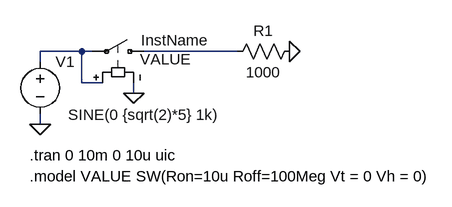
[diagram p0: schematic Switch_Circuit.asc]
Switch_Circuit.asc, the LTspice schematic file:
Version 4
SHEET 1 880 680
WIRE -96 96 -160 96
WIRE -80 96 -96 96
WIRE 144 96 0 96
WIRE -160 112 -160 96
WIRE -96 144 -96 96
WIRE -64 144 -96 144
WIRE -16 160 -16 144
WIRE -160 208 -160 192
FLAG -160 208 0
FLAG 224 96 0
FLAG -16 160 0
SYMBOL res 240 80 R90
WINDOW 0 0 56 VBottom 2
WINDOW 3 32 56 VTop 2
SYMATTR InstName R1
SYMATTR Value 1000
SYMBOL voltage -160 96 R0
WINDOW 3 277 97 Right 2
WINDOW 123 0 0 Left 0
WINDOW 39 0 0 Left 0
SYMATTR InstName V1
SYMATTR Value SINE(0 {sqrt(2)*5} 1k)
SYMBOL sw 16 96 M270
WINDOW 0 17 21 VLeft 2
WINDOW 3 -12 22 VLeft 2
SYMATTR InstName InstName
SYMATTR Value VALUE
TEXT -176 256 Left 2 !.tran 0 10m 0 10u uic
TEXT -176 288 Left 2 !.model VALUE SW(Ron=10u Roff=100Meg Vt = 0 Vh = 0)

The netlist it stands for:
* Switch_Circuit.asc
R1 0 N002 1000
V1 N001 0 SINE(0 {sqrt(2)*5} 1k)
S§InstName N002 N001 N001 0 VALUE
.tran 0 10m 0 10u uic
.model VALUE SW(Ron=10u Roff=100Meg Vt = 0 Vh = 0)
.backanno
.end